# Altium schematic sheet accelerometer.SchDoc
size A4
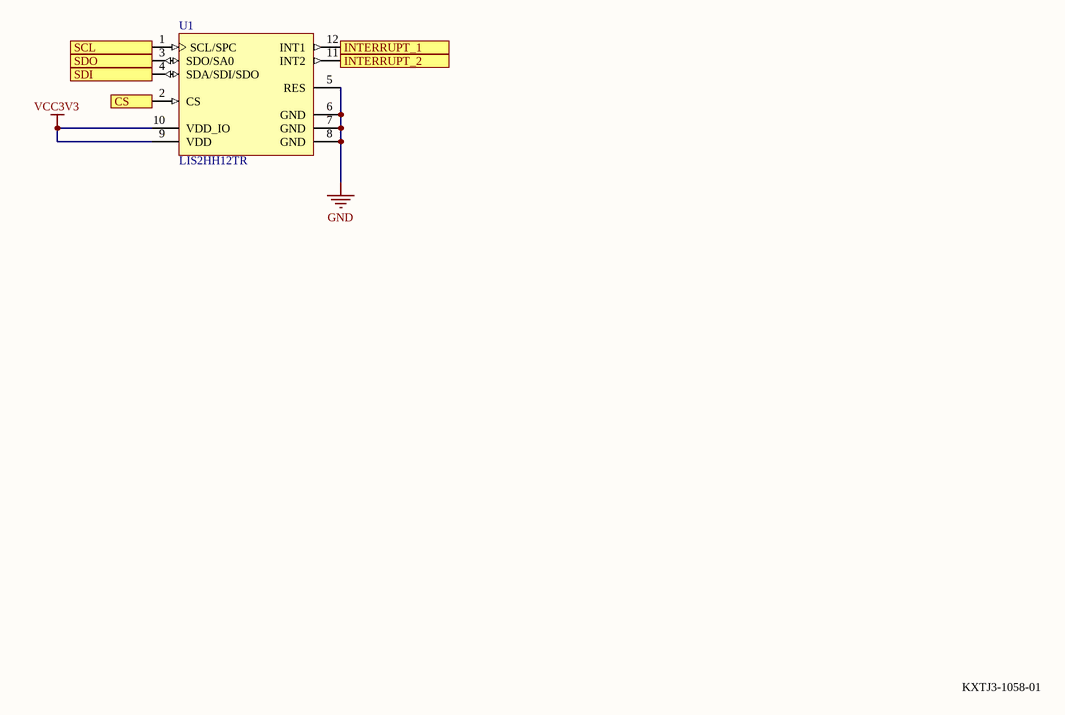
[diagram p0: accelerometer.SchDoc]

## Parts
U1  LIS2HH12TR  [STM-LGA-12]

## Ports
CS, INTERRUPT_1, INTERRUPT_2, SCL, SDI, SDO

## Nets
GND: U1.5(RES) U1.6(GND) U1.7(GND) U1.8(GND)
VCC3V3: U1.9(VDD) U1.10(VDD_IO)
CS: U1.2(CS) ; port CS
INTERRUPT_1: U1.12(INT1) ; port INTERRUPT_1
INTERRUPT_2: U1.11(INT2) ; port INTERRUPT_2
SCL: U1.1(SCL/SPC) ; port SCL
SDI: U1.4(SDA/SDI/SDO) ; port SDI
SDO: U1.3(SDO/SA0) ; port SDO

## Notes on the sheet
- KXTJ3-1058-01

## Library data of the parts
U1 = CMP-2000-07462-1: MEMS Digital Output Motion Sensor: Ultra-Low-Power High-Performance 3-Axis "Pico" Accelerometer, 1.71 to 3.6 V, -40 to 85 degC, 12-Pin LGA, RoHS, Tape and Reel; Manufacturer: STMicroelectronics; Bandwidth: 400Hz; Package Description: 12-Pin Land Grid Array Package, Body 2 x 2 mm, Pitch 0.5 mm; Manufacturer URL: http://www.st.com/; Lead Free: LeadFree; Case\/Package: LGA; RoHSCompliant: true; Min Operating Temperature: -40degC; Mounting Technology: SurfaceMount; Packaging: TapeandReel; Max Operating Temperature: 85degC; Mount: SurfaceMount; Number of Pins: 12; Datasheet URL: http://www.st.com/content/ccc/resource/technical/document/datasheet/c9/16/f2/79/ca/31/47/89/DM00096789.pdf/files/DM00096789.pdf/jcr:content/translations/en.DM00096789.pdf; Contact Plating: Gold; Package Reference: LGA-12; Datasheet Version: Rev. 5, 12/2015